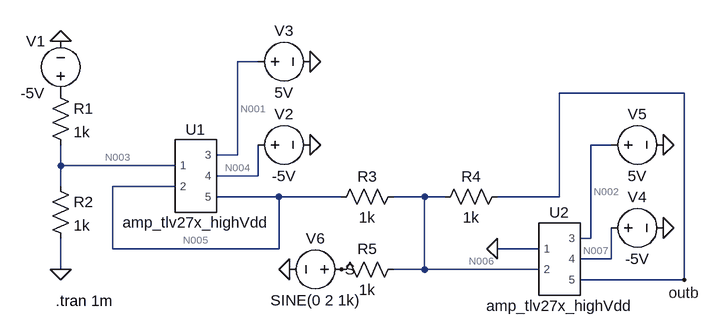
[diagram p0: schematic Pre-Lab-2-b.asc]
Pre-Lab-2-b.asc, the LTspice schematic file:
Version 4.1
SHEET 1 1704 680
WIRE 832 64 800 64
WIRE 1488 112 1296 112
WIRE 1376 192 1344 192
WIRE 800 208 800 64
WIRE 800 208 768 208
WIRE 528 224 528 192
WIRE 704 224 528 224
WIRE 832 240 832 192
WIRE 832 240 768 240
WIRE 528 256 528 224
WIRE 704 256 608 256
WIRE 864 272 768 272
WIRE 960 272 864 272
WIRE 1088 272 1040 272
WIRE 1120 272 1088 272
WIRE 1296 272 1296 112
WIRE 1296 272 1200 272
WIRE 1344 336 1344 192
WIRE 1344 336 1328 336
WIRE 608 352 608 256
WIRE 864 352 864 272
WIRE 864 352 608 352
WIRE 1264 352 1200 352
WIRE 1376 368 1376 320
WIRE 1376 368 1328 368
WIRE 528 384 528 336
WIRE 1088 384 1088 272
WIRE 1088 384 1040 384
WIRE 1264 384 1088 384
WIRE 1488 400 1488 112
WIRE 1488 400 1328 400
FLAG 528 384 0
FLAG 912 64 0
FLAG 528 32 0
FLAG 912 192 0
FLAG 880 384 0
FLAG 1456 192 0
FLAG 1456 320 0
FLAG 1200 352 0
FLAG 1488 400 outb
FLAG 960 384 S
SYMBOL amp_tlv27x_highVdd1 736 240 R0
SYMATTR InstName U1
SYMBOL amp_tlv27x_highVdd1 1296 368 R0
SYMATTR InstName U2
SYMBOL res 512 96 R0
SYMATTR InstName R1
SYMATTR Value 1k
SYMBOL res 512 240 R0
SYMATTR InstName R2
SYMATTR Value 1k
SYMBOL res 1056 256 R90
WINDOW 0 0 56 VBottom 2
WINDOW 3 32 56 VTop 2
SYMATTR InstName R3
SYMATTR Value 1k
SYMBOL res 1216 256 R90
WINDOW 0 0 56 VBottom 2
WINDOW 3 32 56 VTop 2
SYMATTR InstName R4
SYMATTR Value 1k
SYMBOL res 1056 368 R90
WINDOW 0 0 56 VBottom 2
WINDOW 3 32 56 VTop 2
SYMATTR InstName R5
SYMATTR Value 1k
SYMBOL voltage 528 128 R180
WINDOW 0 24 96 Left 2
WINDOW 3 24 16 Left 2
WINDOW 123 0 0 Left 0
WINDOW 39 0 0 Left 0
SYMATTR InstName V1
SYMATTR Value -5V
SYMBOL voltage 816 192 R270
WINDOW 0 32 56 VTop 2
WINDOW 3 -32 56 VBottom 2
WINDOW 123 0 0 Left 0
WINDOW 39 0 0 Left 0
SYMATTR InstName V2
SYMATTR Value -5V
SYMBOL voltage 816 64 R270
WINDOW 0 32 56 VTop 2
WINDOW 3 -32 56 VBottom 2
WINDOW 123 0 0 Left 0
WINDOW 39 0 0 Left 0
SYMATTR InstName V3
SYMATTR Value 5V
SYMBOL voltage 1360 320 R270
WINDOW 0 32 56 VTop 2
WINDOW 3 -32 56 VBottom 2
WINDOW 123 0 0 Left 0
WINDOW 39 0 0 Left 0
SYMATTR InstName V4
SYMATTR Value -5V
SYMBOL voltage 1360 192 R270
WINDOW 0 32 56 VTop 2
WINDOW 3 -32 56 VBottom 2
WINDOW 123 0 0 Left 0
WINDOW 39 0 0 Left 0
SYMATTR InstName V5
SYMATTR Value 5V
SYMBOL voltage 976 384 R90
WINDOW 0 -32 56 VBottom 2
WINDOW 3 32 56 VTop 2
WINDOW 123 0 0 Left 0
WINDOW 39 0 0 Left 0
SYMATTR InstName V6
SYMATTR Value SINE(0 2 1k)
TEXT 520 432 Left 2 !.tran 1m

The netlist it stands for:
* Pre-Lab-2-b.asc
X§U1 N003 N005 N001 N004 N005 amp_tlv27x_highVdd  ; pins 1 2 3 4 5
X§U2 0 N006 N002 N007 outb amp_tlv27x_highVdd  ; pins 1 2 3 4 5
R1 P001 N003 1k
R2 N003 0 1k
R3 N006 N005 1k
R4 outb N006 1k
R5 N006 S 1k
V1 P001 0 -5V
V2 N004 0 -5V
V3 N001 0 5V
V4 N007 0 -5V
V5 N002 0 5V
V6 S 0 SINE(0 2 1k)
.tran 1m
.lib TLV271.LIB
.backanno
.end

* Results of the author's LTspice run, read from the files saved beside the schematic
* Operating Point, zero values left out:
*   V(n001) = 5 V
*   V(n002) = 5 V
*   V(n003) = -2.5 V
*   V(n004) = -5 V
*   V(n005) = -2.499 V
*   V(n006) = -343.4 µV
*   V(n007) = -5 V
*   V(outb) = 2.498 V
*   V(p001) = -5 V
*   I(R1) = -2.5 mA
*   I(R2) = -2.5 mA
*   I(R3) = 2.499 mA
*   I(R4) = 2.499 mA
*   I(R5) = -343.4 nA
*   I(V1) = 2.5 mA
*   I(V2) = 67.78 µA
*   I(V3) = -67.77 µA
*   I(V4) = 67.78 µA
*   I(V5) = -67.78 µA
*   I(V6) = -343.4 nA
*   Ix(u1:1) = -9.402 pA
*   Ix(u1:2) = -9.4 pA
*   Ix(u1:3) = 67.77 µA
*   Ix(u1:4) = -67.78 µA
*   Ix(u1:5) = 2.499 mA
*   Ix(u2:1) = -6.9 pA
*   Ix(u2:2) = -6.901 pA
*   Ix(u2:3) = 67.78 µA
*   Ix(u2:4) = -67.78 µA
*   Ix(u2:5) = -2.499 mA
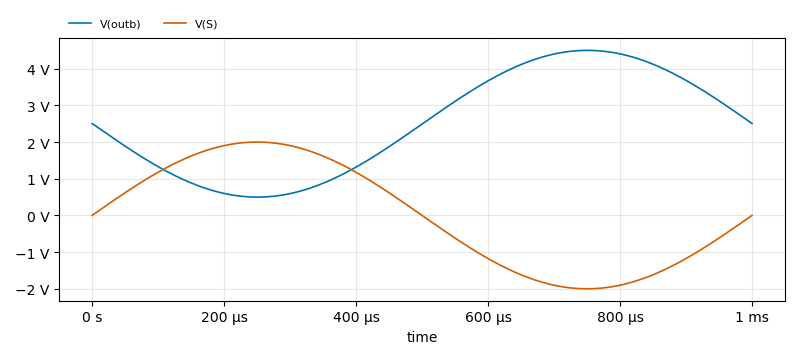
[diagram p1: Transient Analysis of Pre-Lab-2-b.asc, plotted from the saved traces]
* Transient Analysis, 1 run:
*   V(outb): min 498.6 mV, max 4.498 V, average 2.498 V, rms 2.871 V, last 2.507 V
*   V(S): min -2 V, max 2 V, average 0 V, rms 1.414 V, last 0 V